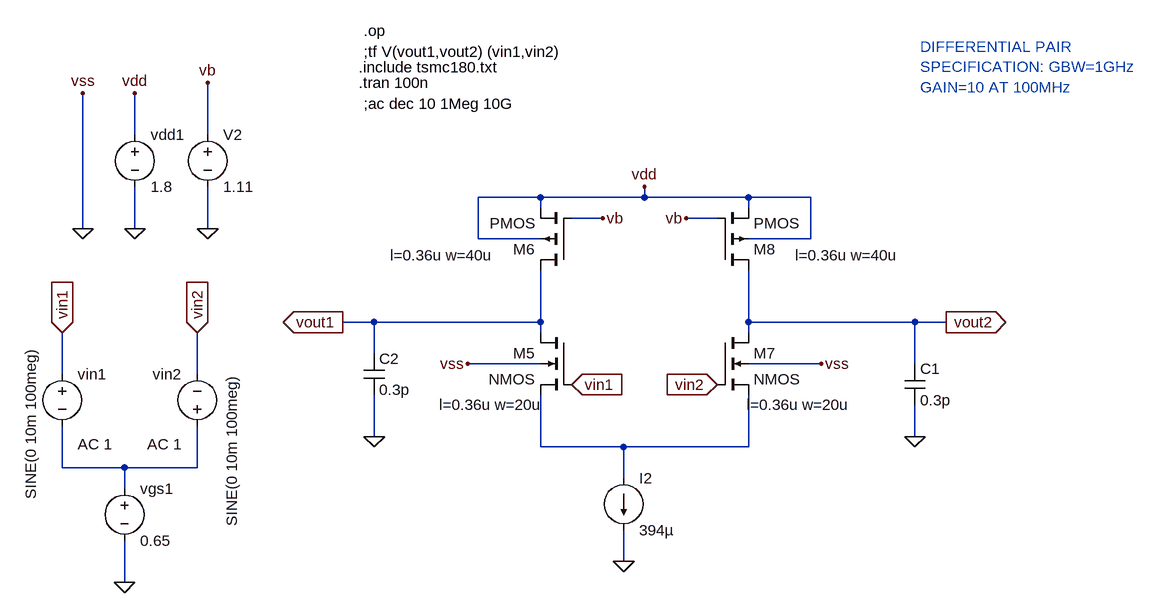
[diagram p0: schematic 1ghzdifferential pair1.asc]
1ghzdifferential pair1.asc, the LTspice schematic file:
Version 4
SHEET 1 1648 680
WIRE -1392 -464 -1392 -528
WIRE -1280 -464 -1280 -544
WIRE -768 -368 -864 -368
WIRE -608 -368 -608 -384
WIRE -608 -368 -768 -368
WIRE -448 -368 -608 -368
WIRE -352 -368 -448 -368
WIRE -768 -352 -768 -368
WIRE -448 -352 -448 -368
WIRE -672 -336 -720 -336
WIRE -496 -336 -544 -336
WIRE -1472 -320 -1472 -528
WIRE -1392 -320 -1392 -384
WIRE -1280 -320 -1280 -384
WIRE -864 -304 -864 -368
WIRE -768 -304 -864 -304
WIRE -352 -304 -352 -368
WIRE -352 -304 -448 -304
WIRE -1024 -176 -1072 -176
WIRE -768 -176 -768 -256
WIRE -768 -176 -1024 -176
WIRE -448 -176 -448 -256
WIRE -192 -176 -448 -176
WIRE -144 -176 -192 -176
WIRE -768 -160 -768 -176
WIRE -448 -160 -448 -176
WIRE -1024 -128 -1024 -176
WIRE -768 -112 -880 -112
WIRE -336 -112 -448 -112
WIRE -192 -112 -192 -176
WIRE -1504 -96 -1504 -160
WIRE -1296 -96 -1296 -160
WIRE -1024 0 -1024 -64
WIRE -192 0 -192 -48
WIRE -768 16 -768 -64
WIRE -640 16 -768 16
WIRE -448 16 -448 -64
WIRE -448 16 -640 16
WIRE -1504 48 -1504 -16
WIRE -1408 48 -1504 48
WIRE -1296 48 -1296 -16
WIRE -1296 48 -1408 48
WIRE -640 64 -640 16
WIRE -1408 80 -1408 48
WIRE -640 192 -640 144
WIRE -1408 224 -1408 160
FLAG -880 -112 vss
FLAG -496 -80 vin2
IOPIN -496 -80 In
FLAG -1072 -176 vout1
IOPIN -1072 -176 Out
FLAG -1024 0 0
FLAG -608 -384 vdd
FLAG -672 -336 vb
FLAG -336 -112 vss
FLAG -720 -80 vin1
IOPIN -720 -80 In
FLAG -144 -176 vout2
IOPIN -144 -176 Out
FLAG -192 0 0
FLAG -544 -336 vb
FLAG -640 192 0
FLAG -1408 224 0
FLAG -1392 -320 0
FLAG -1472 -320 0
FLAG -1472 -528 vss
FLAG -1392 -528 vdd
FLAG -1280 -320 0
FLAG -1280 -544 vb
FLAG -1504 -160 vin1
IOPIN -1504 -160 In
FLAG -1296 -160 vin2
IOPIN -1296 -160 In
SYMBOL nmos4 -720 -160 M0
WINDOW 123 45 111 Left 2
SYMATTR Value2 l=0.36u w=20u
SYMATTR InstName M5
SYMBOL pmos4 -720 -256 R180
WINDOW 123 120 23 Left 2
SYMATTR Value2 l=0.36u w=40u
SYMATTR InstName M6
SYMBOL nmos4 -496 -160 R0
WINDOW 123 45 111 Left 2
SYMATTR Value2 l=0.36u w=20u
SYMATTR InstName M7
SYMBOL pmos4 -496 -256 M180
WINDOW 123 120 23 Left 2
SYMATTR Value2 l=0.36u w=40u
SYMATTR InstName M8
SYMBOL current -640 64 R0
WINDOW 123 0 0 Left 0
WINDOW 39 0 0 Left 0
SYMATTR InstName I2
SYMATTR Value 394µ
SYMBOL voltage -1408 64 R0
WINDOW 123 0 0 Left 0
WINDOW 39 0 0 Left 0
SYMATTR InstName vgs1
SYMATTR Value 0.65
SYMBOL voltage -1504 -112 R0
WINDOW 3 -48 -25 VRight 2
WINDOW 123 24 124 Left 2
WINDOW 39 0 0 Left 0
SYMATTR Value SINE(0 10m 100meg)
SYMATTR Value2 AC 1
SYMATTR InstName vin1
SYMBOL voltage -1296 0 R180
WINDOW 0 24 96 Left 2
WINDOW 3 -53 -138 VRight 2
WINDOW 123 24 -12 Left 2
WINDOW 39 0 0 Left 0
SYMATTR InstName vin2
SYMATTR Value SINE(0 10m 100meg)
SYMATTR Value2 AC 1
SYMBOL voltage -1392 -480 R0
WINDOW 123 0 0 Left 0
WINDOW 39 0 0 Left 0
SYMATTR InstName vdd1
SYMATTR Value 1.8
SYMBOL voltage -1280 -480 R0
WINDOW 123 0 0 Left 0
WINDOW 39 0 0 Left 0
SYMATTR InstName V2
SYMATTR Value 1.11
SYMBOL cap -208 -112 R0
SYMATTR InstName C1
SYMATTR Value 0.3p
SYMBOL cap -1040 -128 R0
SYMATTR InstName C2
SYMATTR Value 0.3p
TEXT -1048 -568 Left 2 !.include tsmc180.txt
TEXT -1040 -624 Left 2 !.op
TEXT -1048 -544 Left 2 !.tran 100n
TEXT -1040 -512 Left 2 !;ac dec 10 1Meg 10G
TEXT -1040 -592 Left 2 !;tf V(vout1,vout2) (vin1,vin2)
TEXT -184 -600 Left 2 ;DIFFERENTIAL PAIR \nSPECIFICATION: GBW=1GHz  \nGAIN=10 AT 100MHz

The netlist it stands for:
* 1ghzdifferential pair1.asc
M5 vout1 vin1 N001 0 NMOS l=0.36u w=20u
M6 vout1 vb vdd vdd PMOS l=0.36u w=40u
M7 vout2 vin2 N001 0 NMOS l=0.36u w=20u
M8 vout2 vb vdd vdd PMOS l=0.36u w=40u
I2 N001 0 394µ
vgs1 N002 0 0.65
vin1 vin1 N002 SINE(0 10m 100meg) AC 1
vin2 N002 vin2 SINE(0 10m 100meg) AC 1
vdd1 vdd 0 1.8
V2 vb 0 1.11
C1 vout2 0 0.3p
C2 vout1 0 0.3p
.model NMOS NMOS
.model PMOS PMOS
.lib standard.mos
.include tsmc180.txt
.op
.tran 100n
;ac dec 10 1Meg 10G
;tf V(vout1,vout2) (vin1,vin2)
* DIFFERENTIAL PAIR
* SPECIFICATION: GBW=1GHz
* GAIN=10 AT 100MHz
.backanno
.end